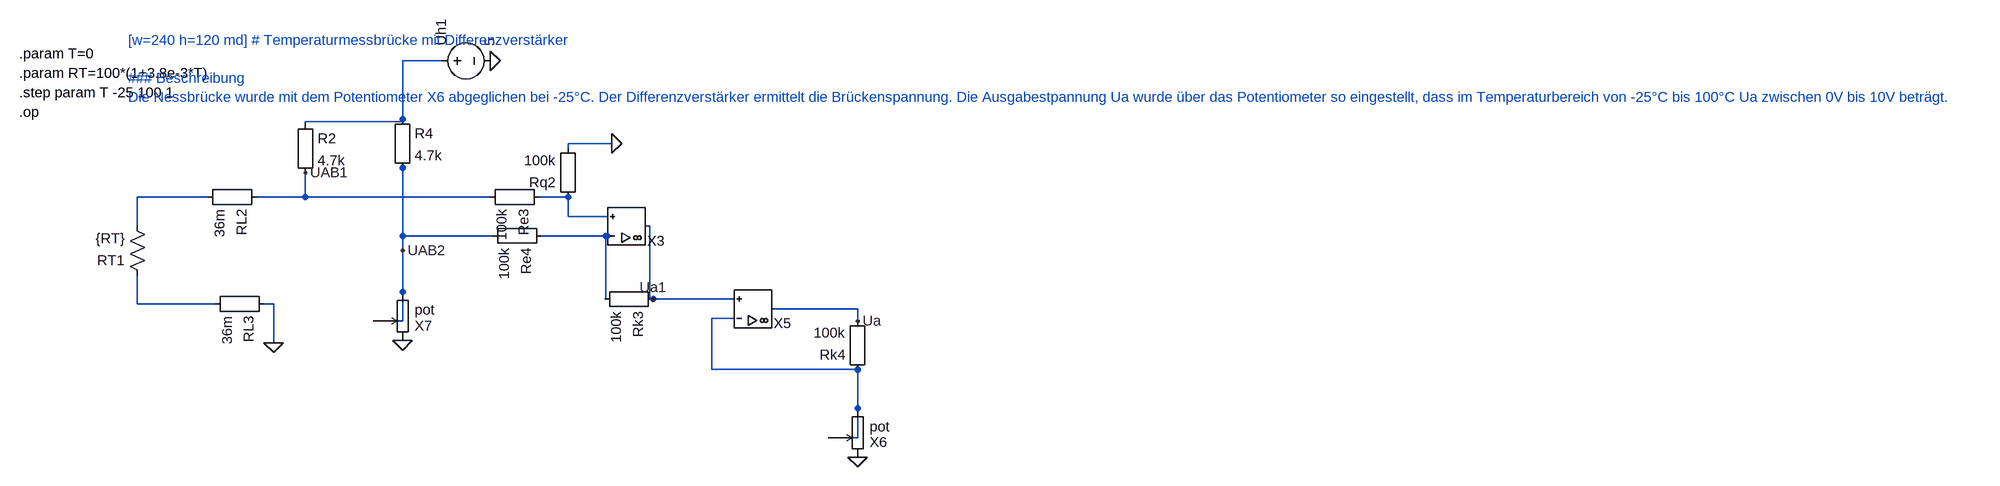
[diagram p0: schematic PT100-Sensor_mit_Brueckenschaltung_Lsg.asc]
PT100-Sensor_mit_Brueckenschaltung_Lsg.asc, the LTspice schematic file:
Version 4
SHEET 1 880 680
WIRE 984 248 912 248
WIRE 912 248 912 256
WIRE 428 576 428 512
WIRE 428 512 412 512
WIRE 976 368 912 368
WIRE 912 368 912 336
WIRE 912 336 864 336
WIRE 976 400 944 400
WIRE 944 400 868 400
WIRE 976 400 974 400
WIRE 974 400 974 504
WIRE 974 504 972 504
WIRE 1040 384 1046 384
WIRE 1046 384 1046 504
WIRE 1046 504 1052 504
WIRE 1052 504 1184 504
WIRE 204 464 204 512
WIRE 204 512 332 512
WIRE 204 384 204 336
WIRE 204 336 320 336
WIRE 400 336 480 336
WIRE 480 336 480 296
WIRE 480 336 784 336
WIRE 704 112 640 112
WIRE 640 112 640 208
WIRE 640 208 640 212
WIRE 640 212 480 212
WIRE 480 212 480 216
WIRE 640 288 640 400
WIRE 640 400 788 400
WIRE 640 288 640 424
WIRE 640 424 640 492
WIRE 640 492 640 540
WIRE 640 540 592 540
WIRE 1184 536 1148 536
WIRE 1148 536 1148 620
WIRE 1148 620 1388 620
WIRE 1388 620 1388 684
WIRE 1388 684 1388 732
WIRE 1388 732 1340 732
WIRE 1248 520 1388 520
WIRE 1388 520 1388 540
FLAG 1052 504 Ua1
FLAG 1388 540 Ua
FLAG 480 296 UAB1
FLAG 640 424 UAB2
FLAG 784 112 0
FLAG 984 248 0
FLAG 1388 764 0
FLAG 428 576 0
FLAG 640 572 0
SYMBOL opamp 1008 384 M180
SYMATTR InstName X3
SYMATTR Prefix X
SYMATTR SpiceModel opamp
SYMBOL res 220 480 R180
SYMATTR InstName RT1
SYMATTR Value {RT}
SYMBOL Misc\EuropeanResistor 416 320 R90
SYMATTR InstName RL2
SYMATTR Value 36m
SYMBOL Misc\EuropeanResistor 428 496 R90
SYMATTR InstName RL3
SYMATTR Value 36m
SYMBOL Misc\EuropeanResistor 880 320 R90
SYMATTR InstName Re3
SYMATTR Value 100k
SYMBOL voltage 688 112 R270
SYMATTR InstName Uh1
SYMATTR Value 5
SYMBOL Misc\EuropeanResistor 464 200 R0
SYMATTR InstName R2
SYMATTR Value 4.7k
SYMBOL Misc\EuropeanResistor 624 192 R0
SYMATTR InstName R4
SYMATTR Value 4.7k
SYMBOL Misc\EuropeanResistor 928 352 R180
SYMATTR InstName Rq2
SYMATTR Value 100k
SYMBOL Misc\EuropeanResistor 1068 488 R90
SYMATTR InstName Rk3
SYMATTR Value 100k
SYMBOL Misc\EuropeanResistor 884 384 R90
SYMATTR InstName Re4
SYMATTR Value 100k
SYMBOL opamp 1216 520 M180
SYMATTR InstName X5
SYMATTR Prefix X
SYMATTR SpiceModel opamp
SYMBOL Misc\EuropeanResistor 1404 636 R180
SYMATTR InstName Rk4
SYMATTR Value 100k
SYMBOL pot 1404 780 R180
SYMATTR InstName X6
SYMATTR Value pot
SYMATTR SpiceLine Rtot=2k wiper=0.2415
SYMATTR LibreSpice pins=A,W,B
SYMBOL pot 656 588 R180
SYMATTR InstName X7
SYMATTR Value pot
SYMATTR SpiceLine Rtot=100 wiper=.90572
SYMATTR LibreSpice pins=A,W,B
TEXT 10 100 Left 2 !.param T=0
TEXT 10 132 Left 2 !.param RT=100*(1+3.8e-3*T)
TEXT 10 164 Left 2 !.step param T -25 100 1
TEXT 10 196 Left 2 !.op
TEXT 189 78 Left 2 ;[w=240 h=120 md] # Temperaturmessbrücke mit Differenzverstärker\n\n### Beschreibung\nDie Nessbrücke wurde mit dem Potentiometer X6 abgeglichen bei -25°C. Der Differenzverstärker ermittelt die Brückenspannung. Die Ausgabestpannung Ua wurde über das Potentiometer so eingestellt, dass im Temperaturbereich von -25°C bis 100°C Ua zwischen 0V bis 10V beträgt.\n

The netlist it stands for:
* PT100-Sensor_mit_Brueckenschaltung_Lsg.asc
XX3 N001 N002 Ua1 opamp opamp  ; pins In+ In- OUT
RT1 N003 N004 {RT}
RL2 UAB1 N004 36m
RL3 0 N003 36m
Re3 N001 UAB1 100k
V§Uh1 N005 0 5
R2 N005 UAB1 4.7k
R4 N005 UAB2 4.7k
Rq2 N001 0 100k
Rk3 Ua1 N002 100k
Re4 N002 UAB2 100k
XX5 Ua1 N006 Ua opamp opamp  ; pins In+ In- OUT
Rk4 N006 Ua 100k
XX6 0 N006 N006 pot pot Rtot=2k wiper=0.2415  ; pins A W B
XX7 0 UAB2 UAB2 pot pot Rtot=100 wiper=.90572  ; pins A W B
.param T=0
.param RT=100*(1+3.8e-3*T)
.step param T -25 100 1
.op
* [w=240 h=120 md] # Temperaturmessbrücke mit Differenzverstärker
* ### Beschreibung
* Die Nessbrücke wurde mit dem Potentiometer X6 abgeglichen bei -25°C. Der Differenzverstärker ermittelt die Brückenspannung. Die Ausgabestpannung Ua wurde über das Potentiometer so eingestellt, dass im Temperaturbereich von -25°C bis 100°C Ua zwischen 0V bis 10V beträgt.
.lib opamp.lib
.lib pot.lib
.backanno
.end